# Altium schematic sheet analog_inputs_blk.SchDoc
size A4; Date: 1/11/2016; Engineer: JBayalas; DocumentNumber: 8; Revision: V4.3.0; SheetNumber: 8; SheetTotal: 12
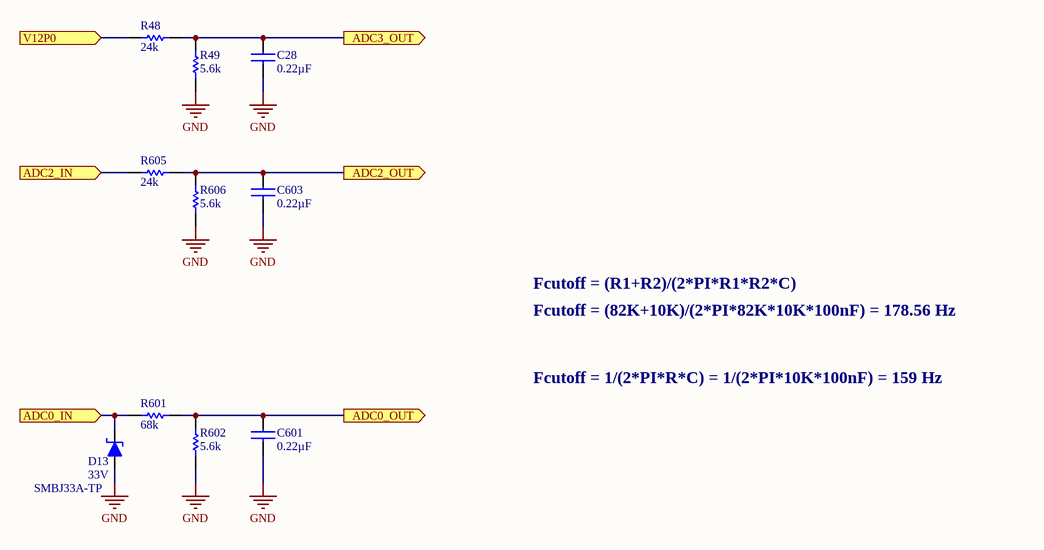
[diagram p0: analog_inputs_blk.SchDoc]

## Parts
C28  value 0.22µF  [C0603]  (hidden comment: GCM188R71H224KA64D)
C601  value 0.22µF  [C0603]  (hidden comment: GCM188R71H224KA64D)
C603  value 0.22µF  [C0603]  (hidden comment: GCM188R71H224KA64D)
D13  RATING: 33V  [DO-214AA, SMB]  (hidden comment: SMBJ33A-TP)
R48  value 24k  [R0603]  (hidden comment: TNPW060324K0BEEA)
R49  value 5.6k  [R0603]  (hidden comment: ERA-3AEB562V)
R601  value 68k  [R0603]  (hidden comment: ERA-3AEB683V)
R602  value 5.6k  [R0603]  (hidden comment: ERA-3AEB562V)
R605  value 24k  [R0603]  (hidden comment: TNPW060324K0BEEA)
R606  value 5.6k  [R0603]  (hidden comment: ERA-3AEB562V)

## Ports
ADC0_IN (in), ADC0_OUT (out), ADC2_IN (in), ADC2_OUT (out), ADC3_OUT (out), V12P0 (in)

## Nets
GND: C28.2 C601.2 C603.2 D13.2(A) R49.1 R602.1 R606.1
ADC0_IN: D13.1(K) R601.1 ; port ADC0_IN
ADC0_OUT: C601.1 R601.2 R602.2 ; port ADC0_OUT
ADC2_IN: R605.1 ; port ADC2_IN
ADC2_OUT: C603.1 R605.2 R606.2 ; port ADC2_OUT
ADC3_OUT: C28.1 R48.2 R49.2 ; port ADC3_OUT
V12P0: R48.1 ; port V12P0

## Notes on the sheet
- Fcutoff = (R1+R2)/(2*PI*R1*R2*C)
- Fcutoff = (82K+10K)/(2*PI*82K*10K*100nF) = 178.56 Hz
- Fcutoff = 1/(2*PI*R*C) = 1/(2*PI*10K*100nF) = 159 Hz
- Title:
- Sheet:
- Date:
- of
- Project:
- Revision:
- Engineer:
- Wi4B S.r.l

## Library data of the parts
C28 C601 C603 = GCM188R71H224KA64D: CAP CER 0.22UF 50V X7R 0603; MFT: Murata Electronics North America; TYPE: Surface Mount, MLCC; FUNCTION: Analog Inputs; MPN: GCM188R71H224KA64D; RATING: 50V
D13 = SMBJ33A-TP: TVS DIODE 33VWM 53.3VC SMB; MFT: Micro Commercial Co; TYPE: Surface Mount; FUNCTION: Analog Inputs; VALUE: SMBJ33A-TP; MPN: SMBJ33A-TP
R48 = TNPW060324K0BEEA: RES 24K OHM 0.1% 1/8W 0603; MFT: Vishay Dale; FUNCTION: Analog Inputs; MPN: TNPW060324K0BEEA; TYPE: SMD; RATING: 1/8W; DNP: *
R49 R602 R606 = ERA-3AEB562V: RES SMD 5.6K OHM 0.1% 1/10W 0603; MFT: Panasonic Electronic Components; FUNCTION: Analog Inputs; MPN: ERA-3AEB562V; TYPE: SMD; RATING: 1/10W; DNP: *
R601 = ERA-3AEB683V: RES SMD 68K OHM 0.1% 1/10W 0603; MFT: Panasonic Electronic Components; FUNCTION: Analog Inputs; MPN: ERA-3AEB683V; TYPE: SMD; RATING: 1/10W; DNP: *
R605 = TNPW060324K0BEEA: RES SMD 24K OHM 0.1% 1/8W 0603; MFT: Vishay Dale; FUNCTION: Analog Inputs; MPN: TNPW060324K0BEEA; TYPE: SMD; RATING: 1/8W; DNP: *